# Altium schematic sheet dcdc-converter.SchDoc
size A3; DocumentNumber: 9; SheetNumber: 9; SheetTotal: 11; SheetDescription: DC/DC-Converter
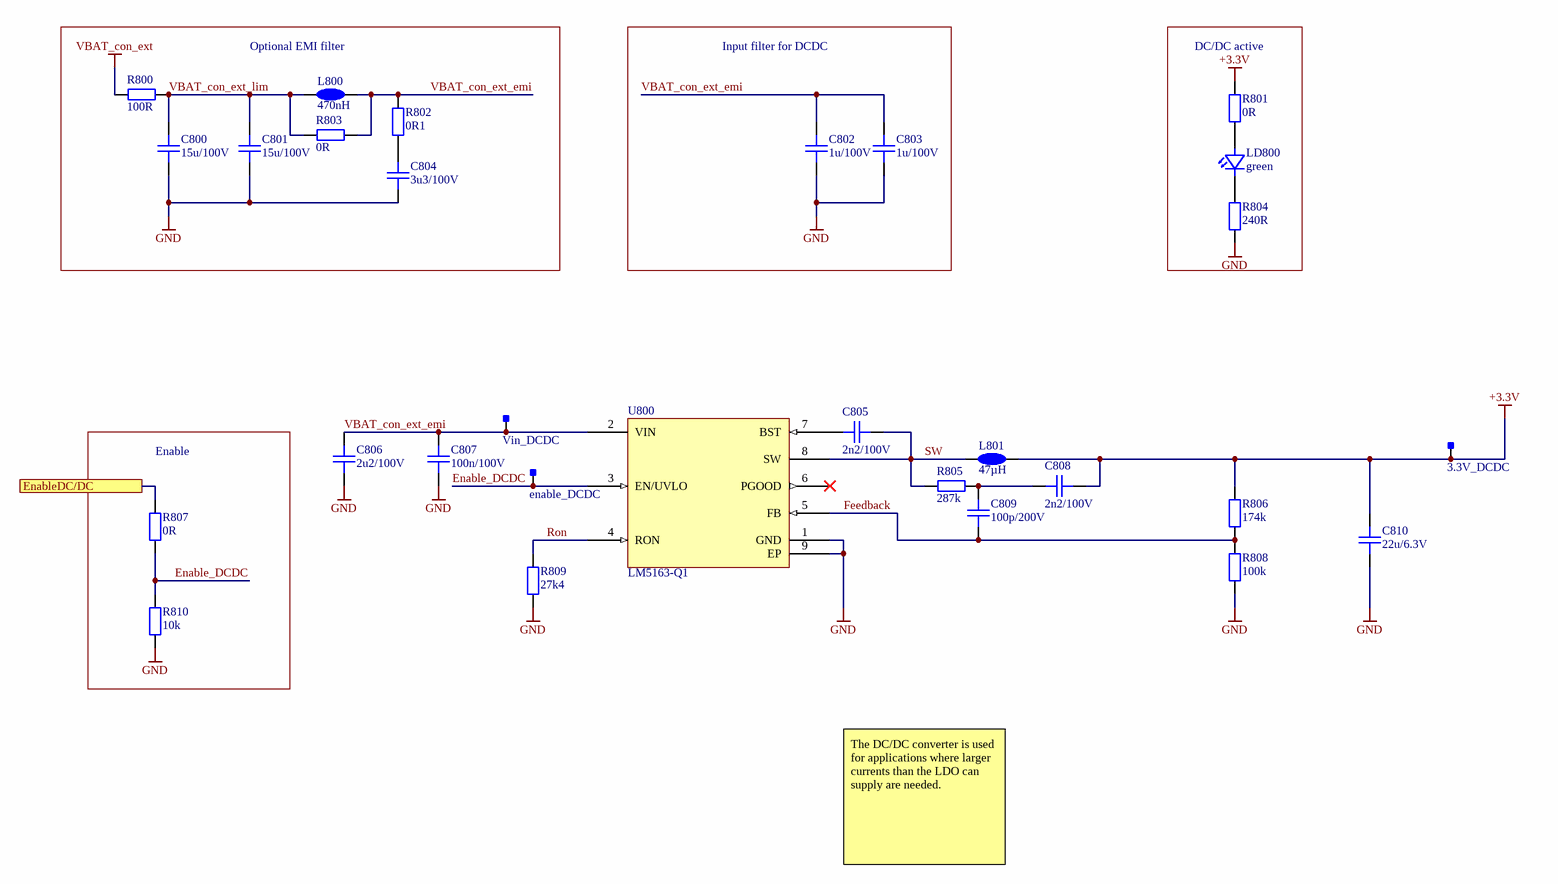
[diagram p0: dcdc-converter.SchDoc]

## Parts
3.3V_DCDC  Testpoint_Square  [Testpoint_S1]  (value not drawn)  (no BOM)
C800  15u/100V  [CAPC6153X67N]
C801  15u/100V  [CAPC6153X67N]
C802  1u/100V  [CAPC3225X25N]
C803  1u/100V  [CAPC3225X25N]
C804  3u3/100V  [CAPC4532X16N]
C805  2n2/100V  [CAPC1005X06N]
C806  2u2/100V  [CAPC3225X25N]
C807  100n/100V  [CAPC1608X08N]
C808  2n2/100V  [CAPC1005X06N]
C809  100p/200V  [CAPC1005X06N]
C810  22u/6.3V  [CAPC3216X18N]
enable_DCDC  Testpoint_Square  [Testpoint_S1]  (value not drawn)  (no BOM)
L800  470nH  [SRP7028A]
L801  47µH  [TYS6045470M-10]
LD800  green  [LEDC1608X07N]
R800  100R  [RESC1608X05N]
R801  0R  [RESC1608X05N]
R802  0R1  [RESC2012X05N]
R803  0R  [RESC1608X05N]
R804  240R  [RESC1608X05N]
R805  287k  [RESC1608X05N]
R806  174k  [RESC1608X05N]
R807  0R  [RESC1608X05N]
R808  100k  [RESC1608X05N]
R809  27k4  [RESC1608X05N]
R810  10k  [RESC1608X05N]
U800  LM5163-Q1  [R-PDSO-G8]
Vin_DCDC  Testpoint_Square  [Testpoint_S1]  (value not drawn)  (no BOM)

## Blocks framed on the sheet
Optional EMI filter: C800 C801 C804 L800 R800 R802 R803
Input filter for DCDC: C802 C803
DC/DC active: LD800 R801 R804
Enable: R807 R810

## Ports
EnableDC/DC

## Nets
+3.3V: 3.3V_DCDC.1 C808.2 C810.2 L801.2 R801.2 R806.2
GND: C800.1 C801.1 C802.1 C803.1 C804.1 C806.1 C807.1 C810.1 R804.1 R808.1 R809.1 R810.2 U800.1(GND) U800.9(EP)
VBAT_con_ext: R800.1
Enable_DCDC: enable_DCDC.1 R807.2 R810.1 U800.3(EN/UVLO)
EnableDC/DC: R807.1 ; port EnableDC/DC
Feedback: C809.1 R806.1 R808.2 U800.5(FB)
Ron: R809.2 U800.4(RON)
SW: C805.2 L801.1 R805.1 U800.8(SW)
VBAT_con_ext_emi: C802.2 C803.2 C806.2 C807.2 L800.2 R802.2 R803.2 U800.2(VIN) Vin_DCDC.1
VBAT_con_ext_lim: C800.2 C801.2 L800.1 R800.2 R803.1
NetC804_2: C804.2 R802.1
NetC805_1: C805.1 U800.7(BST)
NetC808_1: C808.1 C809.2 R805.2
NetLD800_1: LD800.1(C) R804.2
NetLD800_2: LD800.2(A) R801.1

Not connected (* = marked no-connect by the designer): U800 6(PGOOD)*

## Notes on the sheet
- The DC/DC converter is used for applications where larger currents than the LDO can supply are needed.
- Fraunhofer IISB
- Schottkystr. 10
- developed by:
- 91058 Erlangen
- Germany
- Author
- Project
- License
- Description
- File
- Version
- Release Date
- Sheet
- foxbms.org <https://foxbms.org>
- www.iisb.fraunhofer.de <https://www.iisb.fraunhofer.de/>
- foxBMS Team
- /

## Library data of the parts
3.3V_DCDC enable_DCDC Vin_DCDC = Testpoint_Square: Testpoint, square; Automotive Qualified: False; Part Number: Testpoint_Square
C800 C801 = gen_C_ceramic_15u_100V_X7R_2220: Stacked MLCC; Capacitance: 15u; Rated Voltage: 100V; Dielectric: X7R; Case EIA: 2220; Case Metric: 5750; Automotive Qualified: True; Part Number: gen_C_ceramic_15u_100V_X7R_2220; Supplier 1: Farnell; Supplier Part Number 1: 2781468; Supplier 2: Digikey; Supplier Part Number 2: 490-5838-1-ND; Supplier 3: Mouser; Supplier Part Number 3: 81-KCM55WR72A156MH1K
C802 C803 = gen_C_ceramic_1u_100V_X7R_1210: MLCC; Capacitance: 1u; Rated Voltage: 100V; Dielectric: X7R; Case EIA: 1210; Case Metric: 3225; AVT Set: x; Automotive Qualified: True; Part Number: gen_C_ceramic_1u_100V_X7R_1210; Supplier 1: Farnell; Supplier Part Number 1: 1301722
C804 = gen_C_ceramic_3u3_100V_X7R_1812: MLCC; Capacitance: 3u3; Rated Voltage: 100V; Dielectric: X7R; Case EIA: 1812; Case Metric: 4532; Automotive Qualified: True; Part Number: gen_C_ceramic_3u3_100V_X7R_1812; Supplier 1: Farnell; Supplier Part Number 1: 2579025; Supplier 2: Digikey; Supplier Part Number 2: 399-13376-1-ND; Supplier 3: Mouser; Supplier Part Number 3: 80-C1812C335K1RAUTO
C805 = gen_C_ceramic_2n2_100V_X7R_0402: MLCC; Capacitance: 2n2; Rated Voltage: 100V; Dielectric: X7R; Case EIA: 0402; Case Metric: 1005; Automotive Qualified: True; PnP Package: 0402C; Part Number: gen_C_ceramic_2n2_100V_X7R_0402; Supplier 1: Digikey; Supplier Part Number 1: 490-4911-1-ND
C806 = gen_C_ceramic_2u2_100V_X7R_1210: MLCC; Capacitance: 2u2; Rated Voltage: 100V; Dielectric: X7R; Case EIA: 1210; Case Metric: 3225; AVT Set: x; Automotive Qualified: True; Part Number: gen_C_ceramic_2u2_100V_X7R_1210; Supplier 1: Farnell; Supplier Part Number 1: 2781417; Supplier 2: Farnell; Supplier Part Number 2: 2579027
C807 = gen_C_ceramic_100n_100V_X7R_0603: MLCC; Capacitance: 100n; Rated Voltage: 100V; Dielectric: X7R; Case EIA: 0603; Case Metric: 1608; Automotive Qualified: True; PnP Package: 0603C; Part Number: gen_C_ceramic_100n_100V_X7R_0603; Supplier 1: Digikey; Supplier Part Number 1: 490-13420-1-ND; Supplier 2: Mouser; Supplier Part Number 2: 81-GCJ188R72A104KA1D
C808 = gen_C_ceramic_2n2_100V_X7R_0402: MLCC; Capacitance: 2n2; Rated Voltage: 100V; Dielectric: X7R; Case EIA: 0402; Case Metric: 1005; PnP Package: 0402C; Automotive Qualified: True; Part Number: gen_C_ceramic_2n2_100V_X7R_0402; Supplier 1: Digikey; Supplier Part Number 1: 490-4911-1-ND
C809 = gen_C_ceramic_100p_200V_C0G_0402: MLCC; Capacitance: 100p; Rated Voltage: 200V; Dielectric: C0G; Tolerance: 5%; Case EIA: 0402; Case Metric: 1005; PnP Package: 0402C; Automotive Qualified: True; Part Number: gen_C_ceramic_100p_200V_C0G_0402; Supplier 1: Farnell; Supplier Part Number 1: 2426878; Supplier 2: Digikey; Supplier Part Number 2: 399-11551-1-ND; Supplier 3: RS Components; Supplier Part Number 3: 8353949
C810 = gen_C_ceramic_22u_6V3_X7R_1206: MLCC; Capacitance: 22u; Rated Voltage: 6.3V; Dielectric: X7R; Case EIA: 1206; Case Metric: 3216; Automotive Qualified: True; Part Number: gen_C_ceramic_22u_6V3_X7R_1206; Supplier 1: Farnell; Supplier Part Number 1: 2672216; Supplier 2: Farnell; Supplier Part Number 2: 2211066
L800 = SRP7028A-R47M: FIXED IND 470NH 17.5A 4.2 MOHM; Manufacturer: Bourns Inc; Saturation Current: 26A; Automotive Qualified: True; Part Number: SRP7028A-R47M; Operating Temperature: -40°C - +150°C; ComponentLink1Description: Datasheet; ComponentLink1URL: https://www.bourns.com/docs/Product-Datasheets/SRP7028A.pdf; Inductance: 470nH; Rated Current: 17.5A; Supplier 1: Digikey; Supplier Part Number 1: SRP7028A-R47MCT-ND; Supplier 2: Farnell; Supplier Part Number 2: 2434106
L801 = TYS6045470M-10: Power Inductor; Manufacturer: Laird-Signal Integrity Products; Rated Current: 1.2A; Saturation Current: 1.4A; Automotive Qualified: True; Part Number: TYS6045470M-10; Operating Temperature: -55°C - +150°C; ComponentLink1Description: Datasheet; ComponentLink1URL: http://assets.lairdtech.com/home/brandworld/files/TYS6045470M-10.pdf; Inductance: 47µH; Supplier 1: Digikey; Supplier Part Number 1: 240-2745-1-ND
LD800 = LED_0603_green_AECQ: TLMG1100-GS08; Manufacturer: Vishay; Breakdown Voltage: 5V; Continuous Forward Current: 20mA; Forward Voltage @ 20mA: 2.1V; Automotive Qualified: True; Part Number: LED_0603_green_AECQ; Color: green; Supplier 1: Farnell; Supplier Part Number 1: 2293494; PnP Package: LED_0603; Operating Temperature: -40°C - 100°C; ComponentLink1Description: Datasheet; ComponentLink1URL: http://www.farnell.com/datasheets/2049164.pdf; Supplier 2: Digikey; Supplier Part Number 2: 751-1165-1-ND
R800 = gen_R_100R_0603: SMD Resistor 100R 0603; Tolerance: 1%; Power: 0.1W; Case EIA: 0603; Case Metric: 1608; Maximum Working Voltage: 75V; PnP Package: 0603R; Automotive Qualified: True; PnP equipped: x; Part Number: gen_R_100R_0603; Operating Temperature: -55°C - +155°C; Resistance: 100R; Series: E24, E96; PnP Value: 100R; Supplier 1: Digikey; Supplier Part Number 1: P100HCT-ND
R801 R803 R807 = gen_R_0R_0603: SMD Resistor 0R 0603; Power: 0.1W; Case EIA: 0603; Case Metric: 1608; Maximum Working Voltage: 75V; PnP Package: 0603R; Automotive Qualified: True; PnP equipped: x; Part Number: gen_R_0R_0603; Operating Temperature: -55°C - +155°C; Resistance: 0R; Series: Jumper; PnP Value: 0R; Supplier 1: Farnell; Supplier Part Number 1: 2616580
R802 = gen_R_0R1_0805: SMD Resistor 0R1 0805; Power: 250mW; Case EIA: 0805; Maximum Working Voltage: 150V; Automotive Qualified: True; Part Number: gen_R_0R1_0805; Operating Temperature: -55°C - +155°C; Resistance: 0R1; Supplier 1: Farnell; Supplier Part Number 1: 2824733; Supplier 2: Digikey; Supplier Part Number 2: CRM0805AJX-R100ELFCT-ND
R804 = gen_R_240R_0603: SMD Resistor 240R 0603; Tolerance: 1%; Power: 0.1W; Case EIA: 0603; Case Metric: 1608; Maximum Working Voltage: 75V; PnP Package: 0603R; Automotive Qualified: True; AEC-Q Norm: AEC-Q200; Part Number: gen_R_240R_0603; Operating Temperature: -55°C - +155°C; Resistance: 240R; Series: E24; PnP Value: 240R; Supplier 1: Mouser; Supplier Part Number 1: 667-ERJ-3EKF2400V; ECCN: EAR99
R805 = gen_R_287k_0603: SMD Resistor 287k 0603; Tolerance: 1%; Power: 0.1W; Case EIA: 0603; Case Metric: 1608; Maximum Working Voltage: 75V; PnP Package: 0603R; Automotive Qualified: True; AEC-Q Norm: AEC-Q200; Part Number: gen_R_287k_0603; Operating Temperature: -55°C - +155°C; Resistance: 287k; Series: E96; PnP Value: 287k; Supplier 1: Mouser; Supplier Part Number 1: 667-ERJ-3EKF2873V; ECCN: EAR99
R806 = gen_R_174k_0603: SMD Resistor 174k 0603; Tolerance: 1%; Power: 0.1W; Case EIA: 0603; Case Metric: 1608; Maximum Working Voltage: 75V; PnP Package: 0603R; Automotive Qualified: True; AEC-Q Norm: AEC-Q200; Part Number: gen_R_174k_0603; Operating Temperature: -55°C - +155°C; Resistance: 174k; Series: E96; PnP Value: 174k; Supplier 1: Mouser; Supplier Part Number 1: 667-ERJ-3EKF1743V; ECCN: EAR99
R808 = gen_R_100k_0603: SMD Resistor 100k 0603; Tolerance: 1%; Power: 0.1W; Case EIA: 0603; Case Metric: 1608; Maximum Working Voltage: 75V; PnP Package: 0603R; Automotive Qualified: True; PnP equipped: x; Part Number: gen_R_100k_0603; Operating Temperature: -55°C - +155°C; Resistance: 100k; Series: E24, E96; PnP Value: 100k; Supplier 1: Farnell; Supplier Part Number 1: 2303232
R809 = gen_R_27k4_0603: SMD Resistor 27k4 0603; Tolerance: 1%; Power: 0.1W; Case EIA: 0603; Case Metric: 1608; Maximum Working Voltage: 75V; PnP Package: 0603R; Automotive Qualified: True; AEC-Q Norm: AEC-Q 200; Part Number: gen_R_27k4_0603; Operating Temperature: -55°C - +155°C; Resistance: 27k4; Series: E96; PnP Value: 27k4; Supplier 1: Mouser; Supplier Part Number 1: 667-ERJ-3EKF2742V; ECCN: EAR99
R810 = gen_R_10k_0603: SMD Resistor 10k 0603; Tolerance: 1%; Power: 0.1W; Case EIA: 0603; Case Metric: 1608; Maximum Working Voltage: 75V; PnP Package: 0603R; Automotive Qualified: True; Part Number: gen_R_10k_0603; Operating Temperature: -55°C - +155°C; Resistance: 10k; Series: E24, E96; PnP Value: 10k; Supplier 1: Farnell; Supplier Part Number 1: 2073349
U800 = LM5163-Q1: 100-V Input, 0.5-A SynchronousBuck DC/DCConverterwith Ultra-lowIQ; Manufacturer: Texas Instruments; Automotive Qualified: True; Part Number: LM5163-Q1; Part Name: LM5163-Q1; Operating Temperature: -40°C - +125°C; ComponentLink1Description: Datasheet; ComponentLink1URL: http://www.ti.com/lit/ds/symlink/lm5163-q1.pdf; Supplier 1: Digikey; Supplier Part Number 1: 296-53561-1-ND; Supplier 2: Mouser; Supplier Part Number 2: 595-LM5163QDDARQ1